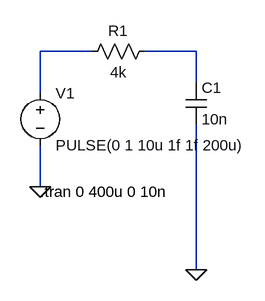
[diagram p0: schematic 1.asc]
1.asc, the LTspice schematic file:
Version 4
SHEET 1 880 680
WIRE 176 96 96 96
WIRE 336 96 256 96
WIRE 336 144 336 96
WIRE 96 160 96 96
WIRE 96 304 96 240
WIRE 336 432 336 208
FLAG 96 304 0
FLAG 336 432 0
SYMBOL res 272 80 R90
WINDOW 0 0 56 VBottom 2
WINDOW 3 32 56 VTop 2
SYMATTR InstName R1
SYMATTR Value 4k
SYMBOL cap 320 144 R0
SYMATTR InstName C1
SYMATTR Value 10n
SYMBOL voltage 96 144 R0
WINDOW 123 0 0 Left 0
WINDOW 39 0 0 Left 0
SYMATTR InstName V1
SYMATTR Value PULSE(0 1 10u 1f 1f 200u)
TEXT 96 312 Left 2 !.tran 0 400u 0 10n

The netlist it stands for:
* 1.asc
R1 N002 N001 4k
C1 N002 0 10n
V1 N001 0 PULSE(0 1 10u 1f 1f 200u)
.tran 0 400u 0 10n
.backanno
.end